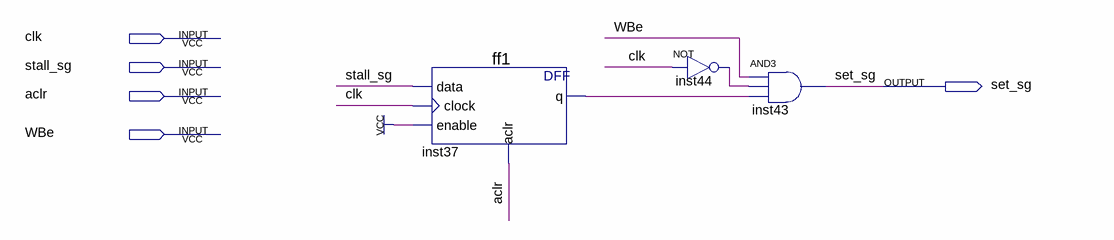
[diagram p0: schematic sheet]
// Quartus schematic set_sg_decode.bdf as structural Verilog: 3 symbols, 5 pins
module set_sg_decode (
  input  clk,
  input  stall_sg,
  input  aclr,
  input  WBe,
  output set_sg
);

  wire inst37_q, inst44_out;

  ff1 inst37 (.data(stall_sg), .clock(clk), .enable(1'b1), .aclr(aclr), .q(inst37_q));
  not inst44 (inst44_out, clk);
  and inst43 (set_sg, WBe, inst44_out, inst37_q);
endmodule
